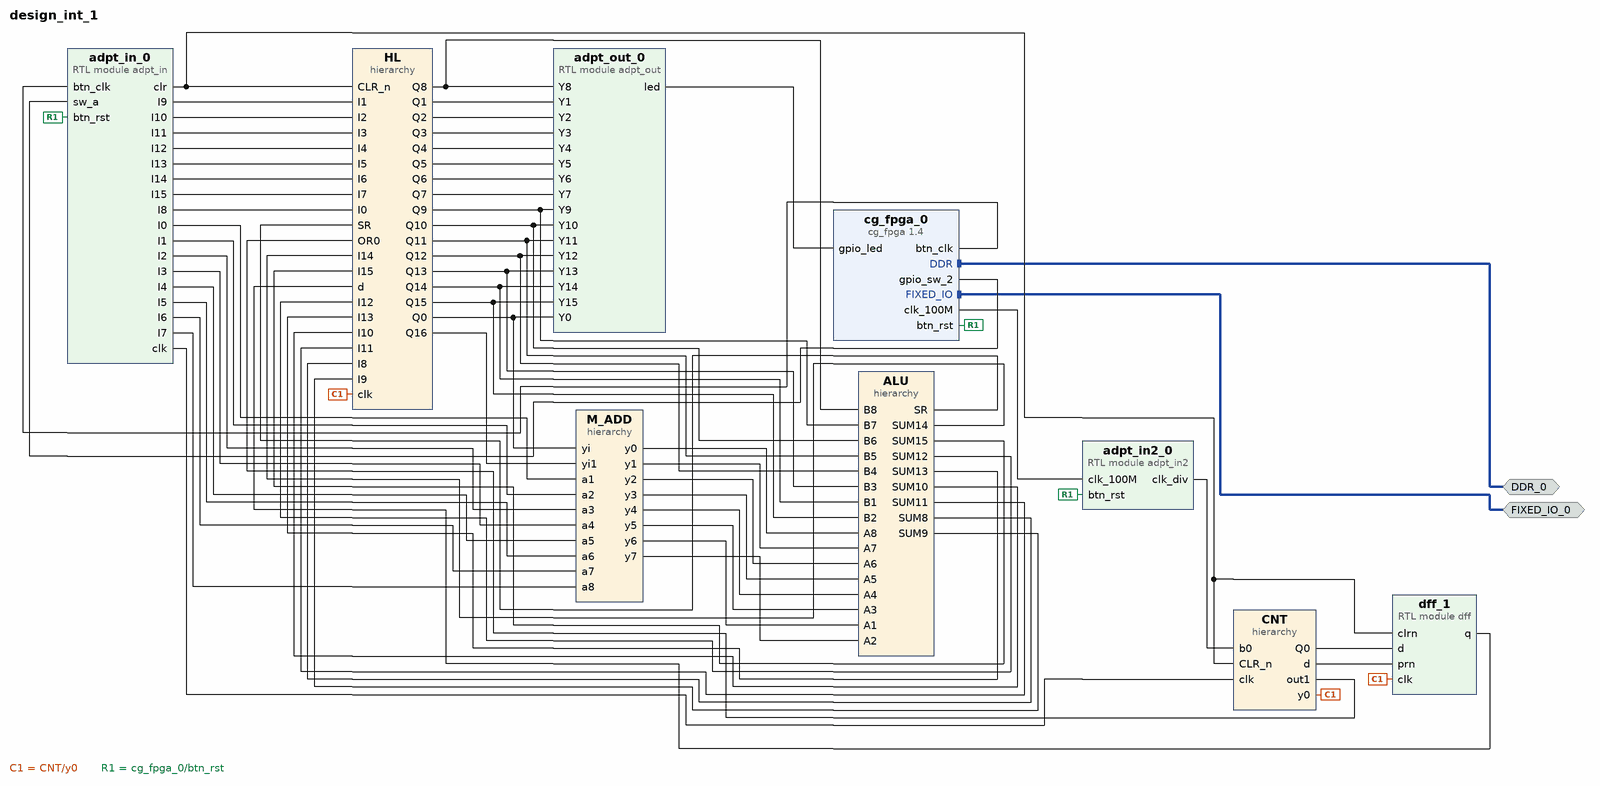
[diagram p0: block diagram of the top level]
# Vivado block design design_int_1, xc7z020clg400-1, Vivado 2024.2
create_bd_design design_int_1

create_bd_intf_port -mode Master -vlnv xilinx.com:display_processing_system7:fixedio_rtl:1.0 FIXED_IO_0
create_bd_intf_port -mode Master -vlnv xilinx.com:interface:ddrx_rtl:1.0 DDR_0

create_bd_cell -type ip -vlnv educg.net:user:cg_fpga:1.4 cg_fpga_0
create_bd_cell -type module -reference adpt_in adpt_in_0
create_bd_cell -type module -reference adpt_out adpt_out_0
create_bd_cell -type hier HL
create_bd_cell -type hier ALU
create_bd_cell -type module -reference dff dff_1
create_bd_cell -type module -reference adpt_in2 adpt_in2_0
create_bd_cell -type hier CNT
create_bd_cell -type hier M_ADD

# ---- hierarchy /HL ----
current_bd_instance /HL
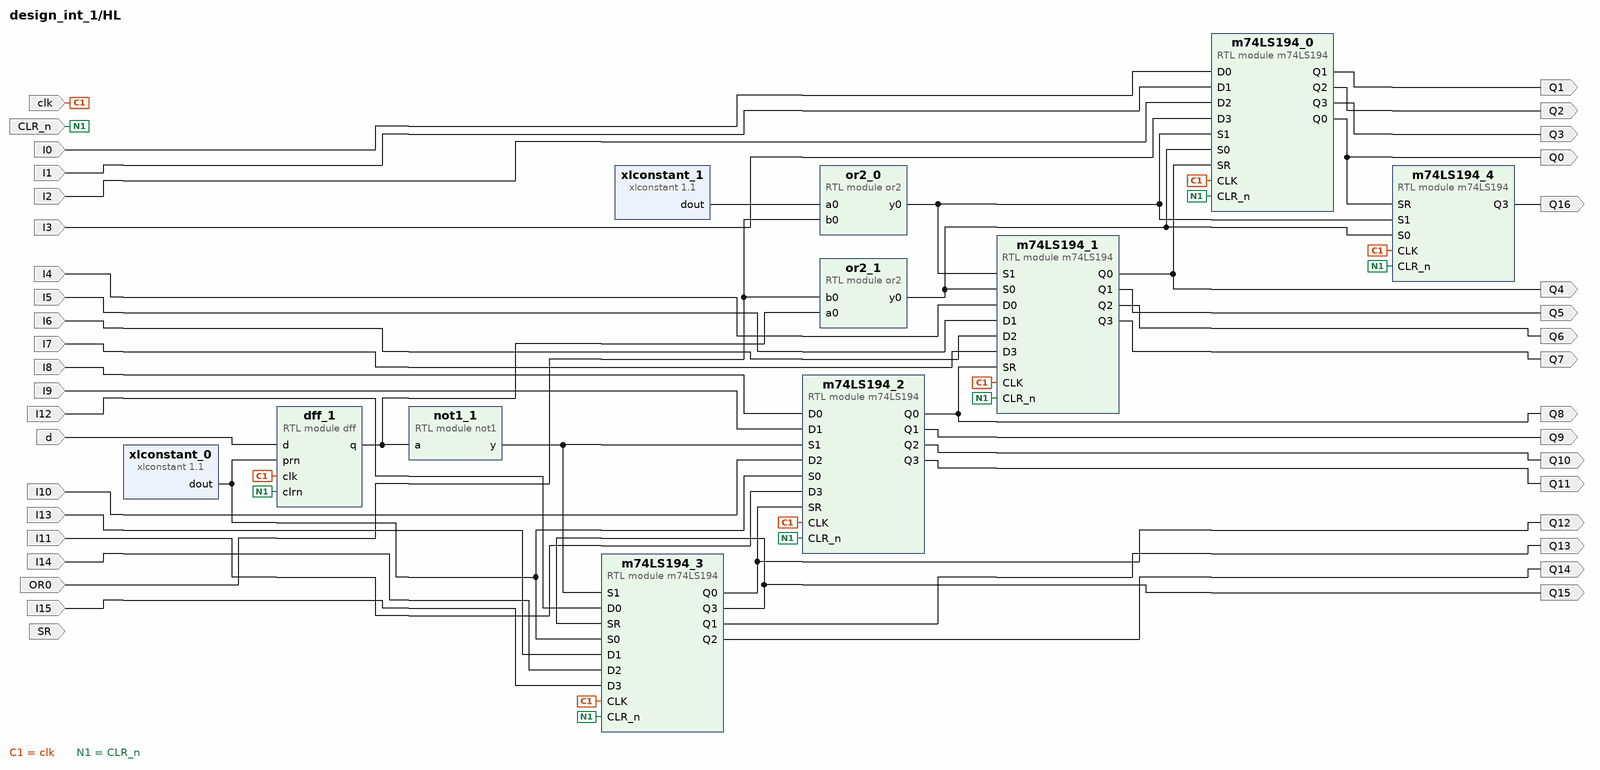
[diagram p1: block diagram inside /HL]
create_bd_pin -dir I -type clk clk
create_bd_pin -dir I CLR_n
create_bd_pin -dir I I3
create_bd_pin -dir I I2
create_bd_pin -dir I I1
create_bd_pin -dir I I0
create_bd_pin -dir O Q4
create_bd_pin -dir O Q3
create_bd_pin -dir O Q2
create_bd_pin -dir O Q1
create_bd_pin -dir O Q0
create_bd_pin -dir I I7
create_bd_pin -dir I I6
create_bd_pin -dir I I5
create_bd_pin -dir I I4
create_bd_pin -dir O Q8
create_bd_pin -dir O Q7
create_bd_pin -dir O Q6
create_bd_pin -dir O Q5
create_bd_pin -dir I I11
create_bd_pin -dir I I10
create_bd_pin -dir I I9
create_bd_pin -dir I I8
create_bd_pin -dir O Q12
create_bd_pin -dir O Q11
create_bd_pin -dir O Q10
create_bd_pin -dir O Q9
create_bd_pin -dir I I15
create_bd_pin -dir I I14
create_bd_pin -dir I I13
create_bd_pin -dir I I12
create_bd_pin -dir O Q15
create_bd_pin -dir O Q14
create_bd_pin -dir O Q13
create_bd_pin -dir I SR
create_bd_pin -dir I d
create_bd_pin -dir I OR0
create_bd_pin -dir O Q16

create_bd_cell -type module -reference m74LS194 m74LS194_0
create_bd_cell -type module -reference m74LS194 m74LS194_1
create_bd_cell -type module -reference m74LS194 m74LS194_2
create_bd_cell -type module -reference m74LS194 m74LS194_3
create_bd_cell -type module -reference dff dff_1
create_bd_cell -type module -reference not1 not1_1
create_bd_cell -type ip -vlnv xilinx.com:ip:xlconstant:1.1 xlconstant_0
create_bd_cell -type ip -vlnv xilinx.com:ip:xlconstant:1.1 xlconstant_1
set_property -dict {CONFIG.CONST_VAL 0} [get_bd_cells xlconstant_1]
create_bd_cell -type module -reference or2 or2_0
create_bd_cell -type module -reference or2 or2_1
create_bd_cell -type module -reference m74LS194 m74LS194_4

# ---- hierarchy /ALU ----
current_bd_instance /ALU
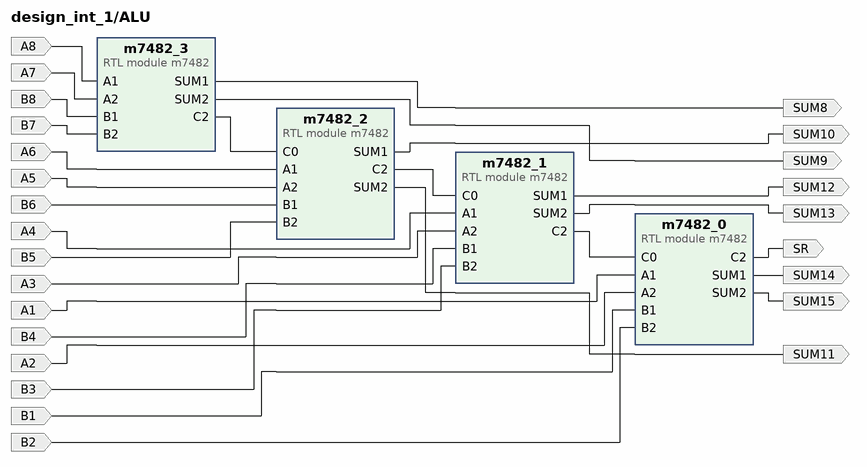
[diagram p2: block diagram inside /ALU]
create_bd_pin -dir I A2
create_bd_pin -dir I A1
create_bd_pin -dir I B2
create_bd_pin -dir I B1
create_bd_pin -dir O SUM15
create_bd_pin -dir O SUM14
create_bd_pin -dir O SR
create_bd_pin -dir I A3
create_bd_pin -dir I A4
create_bd_pin -dir I B3
create_bd_pin -dir I B4
create_bd_pin -dir O SUM13
create_bd_pin -dir O SUM12
create_bd_pin -dir I A5
create_bd_pin -dir I A6
create_bd_pin -dir I B5
create_bd_pin -dir I B6
create_bd_pin -dir O SUM11
create_bd_pin -dir O SUM10
create_bd_pin -dir I A7
create_bd_pin -dir I A8
create_bd_pin -dir I B7
create_bd_pin -dir I B8
create_bd_pin -dir O SUM9
create_bd_pin -dir O SUM8

create_bd_cell -type module -reference m7482 m7482_0
create_bd_cell -type module -reference m7482 m7482_1
create_bd_cell -type module -reference m7482 m7482_2
create_bd_cell -type module -reference m7482 m7482_3

# ---- hierarchy /CNT ----
current_bd_instance /CNT
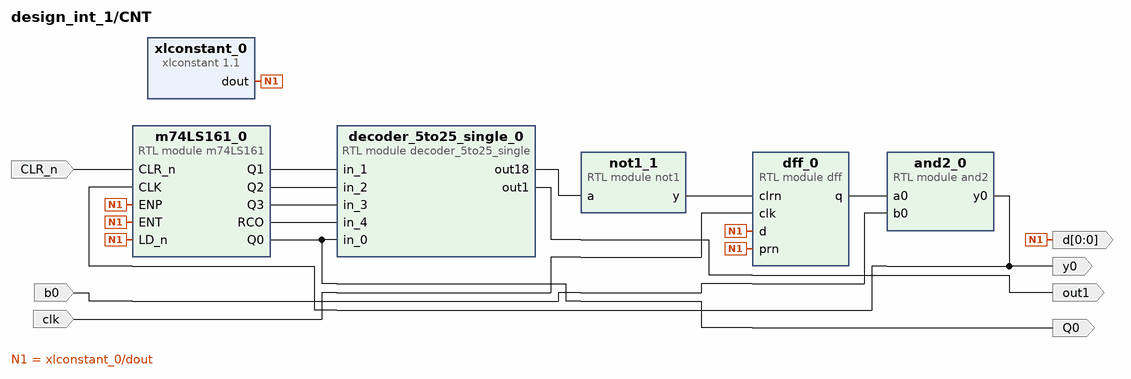
[diagram p3: block diagram inside /CNT]
create_bd_pin -dir O Q0
create_bd_pin -dir O out1
create_bd_pin -dir O -from 0 -to 0 d
create_bd_pin -dir O y0
create_bd_pin -dir I CLR_n
create_bd_pin -dir I -type clk clk
create_bd_pin -dir I b0

create_bd_cell -type module -reference decoder_5to25_single decoder_5to25_single_0
create_bd_cell -type ip -vlnv xilinx.com:ip:xlconstant:1.1 xlconstant_0
create_bd_cell -type module -reference m74LS161 m74LS161_0
create_bd_cell -type module -reference dff dff_0
create_bd_cell -type module -reference not1 not1_1
create_bd_cell -type module -reference and2 and2_0

# ---- hierarchy /M_ADD ----
current_bd_instance /M_ADD
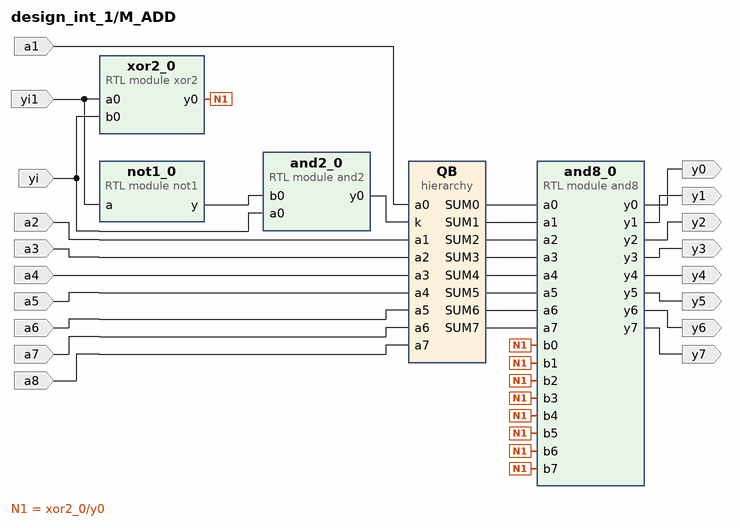
[diagram p4: block diagram inside /M_ADD]
create_bd_pin -dir O y0
create_bd_pin -dir O y1
create_bd_pin -dir O y2
create_bd_pin -dir O y3
create_bd_pin -dir O y4
create_bd_pin -dir O y5
create_bd_pin -dir O y6
create_bd_pin -dir O y7
create_bd_pin -dir I yi1
create_bd_pin -dir I yi
create_bd_pin -dir I a1
create_bd_pin -dir I a2
create_bd_pin -dir I a3
create_bd_pin -dir I a4
create_bd_pin -dir I a5
create_bd_pin -dir I a6
create_bd_pin -dir I a7
create_bd_pin -dir I a8

create_bd_cell -type module -reference and8 and8_0
create_bd_cell -type module -reference xor2 xor2_0
create_bd_cell -type module -reference and2 and2_0
create_bd_cell -type module -reference not1 not1_0
create_bd_cell -type hier QB

# ---- hierarchy /M_ADD/QB ----
current_bd_instance /M_ADD/QB
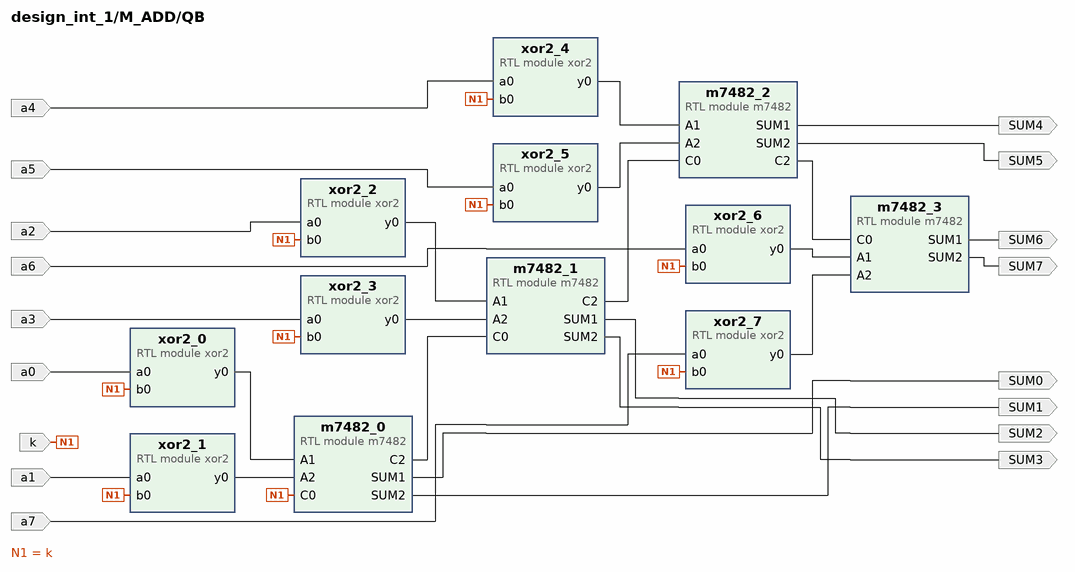
[diagram p5: block diagram inside /M_ADD/QB]
create_bd_pin -dir I a0
create_bd_pin -dir I k
create_bd_pin -dir I a1
create_bd_pin -dir O SUM1
create_bd_pin -dir O SUM0
create_bd_pin -dir I a2
create_bd_pin -dir I a3
create_bd_pin -dir O SUM3
create_bd_pin -dir O SUM2
create_bd_pin -dir O SUM5
create_bd_pin -dir O SUM4
create_bd_pin -dir I a4
create_bd_pin -dir I a5
create_bd_pin -dir I a6
create_bd_pin -dir I a7
create_bd_pin -dir O SUM7
create_bd_pin -dir O SUM6

create_bd_cell -type module -reference xor2 xor2_0
create_bd_cell -type module -reference xor2 xor2_1
create_bd_cell -type module -reference m7482 m7482_0
create_bd_cell -type module -reference xor2 xor2_2
create_bd_cell -type module -reference xor2 xor2_3
create_bd_cell -type module -reference m7482 m7482_1
create_bd_cell -type module -reference m7482 m7482_2
create_bd_cell -type module -reference xor2 xor2_4
create_bd_cell -type module -reference xor2 xor2_5
create_bd_cell -type module -reference xor2 xor2_6
create_bd_cell -type module -reference xor2 xor2_7
create_bd_cell -type module -reference m7482 m7482_3

# ---- connections ----

current_bd_instance /HL
connect_bd_net -net adpt_in_0_I0 [get_bd_pins I0] [get_bd_pins m74LS194_0/D0]
connect_bd_net -net adpt_in_0_I1 [get_bd_pins I1] [get_bd_pins m74LS194_0/D1]
connect_bd_net -net adpt_in_0_I2 [get_bd_pins I2] [get_bd_pins m74LS194_0/D2]
connect_bd_net -net adpt_in_0_I3 [get_bd_pins I3] [get_bd_pins m74LS194_0/D3]
connect_bd_net -net adpt_in_0_I4 [get_bd_pins I4] [get_bd_pins m74LS194_1/D0]
connect_bd_net -net adpt_in_0_I5 [get_bd_pins I5] [get_bd_pins m74LS194_1/D1]
connect_bd_net -net adpt_in_0_I6 [get_bd_pins I6] [get_bd_pins m74LS194_1/D2]
connect_bd_net -net adpt_in_0_I7 [get_bd_pins I7] [get_bd_pins m74LS194_1/D3]
connect_bd_net -net adpt_in_0_I8 [get_bd_pins I8] [get_bd_pins m74LS194_2/D0]
connect_bd_net -net adpt_in_0_I9 [get_bd_pins I9] [get_bd_pins m74LS194_2/D1]
connect_bd_net -net adpt_in_0_I10 [get_bd_pins I10] [get_bd_pins m74LS194_2/D2]
connect_bd_net -net adpt_in_0_I11 [get_bd_pins I11] [get_bd_pins m74LS194_2/D3]
connect_bd_net -net adpt_in_0_I12 [get_bd_pins I12] [get_bd_pins m74LS194_3/D0]
connect_bd_net -net adpt_in_0_I13 [get_bd_pins I13] [get_bd_pins m74LS194_3/D1]
connect_bd_net -net adpt_in_0_I14 [get_bd_pins I14] [get_bd_pins m74LS194_3/D2]
connect_bd_net -net adpt_in_0_I15 [get_bd_pins I15] [get_bd_pins m74LS194_3/D3]
connect_bd_net -net adpt_in_0_clk [get_bd_pins clk] \
  [get_bd_pins dff_1/clk] [get_bd_pins m74LS194_0/CLK] [get_bd_pins m74LS194_1/CLK] [get_bd_pins m74LS194_2/CLK] \
  [get_bd_pins m74LS194_3/CLK] [get_bd_pins m74LS194_4/CLK]
connect_bd_net -net adpt_in_0_clr [get_bd_pins CLR_n] \
  [get_bd_pins dff_1/clrn] [get_bd_pins m74LS194_0/CLR_n] [get_bd_pins m74LS194_1/CLR_n] [get_bd_pins m74LS194_2/CLR_n] \
  [get_bd_pins m74LS194_3/CLR_n] [get_bd_pins m74LS194_4/CLR_n]
connect_bd_net -net b0_1 [get_bd_pins OR0] [get_bd_pins or2_0/b0] [get_bd_pins or2_1/b0]
connect_bd_net [get_bd_pins d] [get_bd_pins dff_1/d]
connect_bd_net [get_bd_pins dff_1/q] [get_bd_pins not1_1/a] [get_bd_pins or2_1/a0]
connect_bd_net [get_bd_pins m74LS194_0/Q0] [get_bd_pins Q0] [get_bd_pins m74LS194_4/SR]
connect_bd_net [get_bd_pins m74LS194_0/Q1] [get_bd_pins Q1]
connect_bd_net [get_bd_pins m74LS194_0/Q2] [get_bd_pins Q2]
connect_bd_net [get_bd_pins m74LS194_0/Q3] [get_bd_pins Q3]
connect_bd_net [get_bd_pins m74LS194_1/Q0] [get_bd_pins Q4] [get_bd_pins m74LS194_0/SR]
connect_bd_net [get_bd_pins m74LS194_1/Q1] [get_bd_pins Q5]
connect_bd_net [get_bd_pins m74LS194_1/Q2] [get_bd_pins Q6]
connect_bd_net [get_bd_pins m74LS194_1/Q3] [get_bd_pins Q7]
connect_bd_net [get_bd_pins m74LS194_2/Q0] [get_bd_pins Q8] [get_bd_pins m74LS194_1/SR]
connect_bd_net [get_bd_pins m74LS194_2/Q1] [get_bd_pins Q9]
connect_bd_net [get_bd_pins m74LS194_2/Q2] [get_bd_pins Q10]
connect_bd_net [get_bd_pins m74LS194_2/Q3] [get_bd_pins Q11]
connect_bd_net [get_bd_pins m74LS194_3/Q0] [get_bd_pins Q12] [get_bd_pins m74LS194_2/SR]
connect_bd_net [get_bd_pins m74LS194_3/Q1] [get_bd_pins Q13]
connect_bd_net [get_bd_pins m74LS194_3/Q2] [get_bd_pins Q14]
connect_bd_net [get_bd_pins m74LS194_3/Q3] [get_bd_pins Q15] [get_bd_pins m74LS194_3/SR]
connect_bd_net [get_bd_pins m74LS194_4/Q3] [get_bd_pins Q16]
connect_bd_net [get_bd_pins not1_1/y] [get_bd_pins m74LS194_2/S1] [get_bd_pins m74LS194_3/S1]
connect_bd_net [get_bd_pins or2_0/y0] [get_bd_pins m74LS194_0/S1] [get_bd_pins m74LS194_1/S1] [get_bd_pins m74LS194_4/S1]
connect_bd_net [get_bd_pins or2_1/y0] [get_bd_pins m74LS194_0/S0] [get_bd_pins m74LS194_1/S0] [get_bd_pins m74LS194_4/S0]
connect_bd_net [get_bd_pins xlconstant_0/dout] [get_bd_pins dff_1/prn] [get_bd_pins m74LS194_2/S0] [get_bd_pins m74LS194_3/S0]
connect_bd_net [get_bd_pins xlconstant_1/dout] [get_bd_pins or2_0/a0]

current_bd_instance /ALU
connect_bd_net -net and8_0_y0 [get_bd_pins A8] [get_bd_pins m7482_3/A1]
connect_bd_net -net and8_0_y1 [get_bd_pins A7] [get_bd_pins m7482_3/A2]
connect_bd_net -net and8_0_y2 [get_bd_pins A6] [get_bd_pins m7482_2/A1]
connect_bd_net -net and8_0_y3 [get_bd_pins A5] [get_bd_pins m7482_2/A2]
connect_bd_net -net and8_0_y4 [get_bd_pins A4] [get_bd_pins m7482_1/A1]
connect_bd_net -net and8_0_y5 [get_bd_pins A3] [get_bd_pins m7482_1/A2]
connect_bd_net -net and8_0_y6 [get_bd_pins A1] [get_bd_pins m7482_0/A1]
connect_bd_net -net and8_0_y7 [get_bd_pins A2] [get_bd_pins m7482_0/A2]
connect_bd_net [get_bd_pins m7482_0/C2] [get_bd_pins SR]
connect_bd_net [get_bd_pins m7482_0/SUM1] [get_bd_pins SUM14]
connect_bd_net [get_bd_pins m7482_0/SUM2] [get_bd_pins SUM15]
connect_bd_net [get_bd_pins m7482_1/C2] [get_bd_pins m7482_0/C0]
connect_bd_net [get_bd_pins m7482_1/SUM1] [get_bd_pins SUM12]
connect_bd_net [get_bd_pins m7482_1/SUM2] [get_bd_pins SUM13]
connect_bd_net [get_bd_pins m7482_2/C2] [get_bd_pins m7482_1/C0]
connect_bd_net [get_bd_pins m7482_2/SUM1] [get_bd_pins SUM10]
connect_bd_net [get_bd_pins m7482_2/SUM2] [get_bd_pins SUM11]
connect_bd_net [get_bd_pins m7482_3/C2] [get_bd_pins m7482_2/C0]
connect_bd_net [get_bd_pins m7482_3/SUM1] [get_bd_pins SUM8]
connect_bd_net [get_bd_pins m7482_3/SUM2] [get_bd_pins SUM9]
connect_bd_net -net m74LS194_2_Q0 [get_bd_pins B8] [get_bd_pins m7482_3/B1]
connect_bd_net -net m74LS194_2_Q1 [get_bd_pins B7] [get_bd_pins m7482_3/B2]
connect_bd_net -net m74LS194_2_Q2 [get_bd_pins B6] [get_bd_pins m7482_2/B1]
connect_bd_net -net m74LS194_2_Q3 [get_bd_pins B5] [get_bd_pins m7482_2/B2]
connect_bd_net -net m74LS194_3_Q0 [get_bd_pins B4] [get_bd_pins m7482_1/B1]
connect_bd_net -net m74LS194_3_Q1 [get_bd_pins B3] [get_bd_pins m7482_1/B2]
connect_bd_net -net m74LS194_3_Q2 [get_bd_pins B1] [get_bd_pins m7482_0/B1]
connect_bd_net -net m74LS194_3_Q3 [get_bd_pins B2] [get_bd_pins m7482_0/B2]

current_bd_instance /CNT
connect_bd_net [get_bd_pins CLR_n] [get_bd_pins m74LS161_0/CLR_n]
connect_bd_net -net adpt_in2_0_clk_div [get_bd_pins b0] [get_bd_pins and2_0/b0]
connect_bd_net -net adpt_in_0_clk [get_bd_pins and2_0/y0] [get_bd_pins y0] [get_bd_pins m74LS161_0/CLK]
connect_bd_net -net adpt_in_0_clk1 [get_bd_pins clk] [get_bd_pins dff_0/clk]
connect_bd_net [get_bd_pins decoder_5to25_single_0/out1] [get_bd_pins out1]
connect_bd_net [get_bd_pins decoder_5to25_single_0/out18] [get_bd_pins not1_1/a]
connect_bd_net [get_bd_pins dff_0/q] [get_bd_pins and2_0/a0]
connect_bd_net [get_bd_pins m74LS161_0/Q0] [get_bd_pins Q0] [get_bd_pins decoder_5to25_single_0/in_0]
connect_bd_net [get_bd_pins m74LS161_0/Q1] [get_bd_pins decoder_5to25_single_0/in_1]
connect_bd_net [get_bd_pins m74LS161_0/Q2] [get_bd_pins decoder_5to25_single_0/in_2]
connect_bd_net [get_bd_pins m74LS161_0/Q3] [get_bd_pins decoder_5to25_single_0/in_3]
connect_bd_net [get_bd_pins m74LS161_0/RCO] [get_bd_pins decoder_5to25_single_0/in_4]
connect_bd_net [get_bd_pins not1_1/y] [get_bd_pins dff_0/clrn]
connect_bd_net [get_bd_pins xlconstant_0/dout] \
  [get_bd_pins d] [get_bd_pins dff_0/d] [get_bd_pins dff_0/prn] [get_bd_pins m74LS161_0/ENP] [get_bd_pins m74LS161_0/ENT] \
  [get_bd_pins m74LS161_0/LD_n]

current_bd_instance /M_ADD
connect_bd_net -net HL_Q0 [get_bd_pins yi1] [get_bd_pins not1_0/a] [get_bd_pins xor2_0/a0]
connect_bd_net -net adpt_in_0_I0 [get_bd_pins a1] [get_bd_pins QB/a0]
connect_bd_net -net adpt_in_0_I1 [get_bd_pins a2] [get_bd_pins QB/a1]
connect_bd_net -net adpt_in_0_I2 [get_bd_pins a3] [get_bd_pins QB/a2]
connect_bd_net -net adpt_in_0_I3 [get_bd_pins a4] [get_bd_pins QB/a3]
connect_bd_net -net adpt_in_0_I4 [get_bd_pins a5] [get_bd_pins QB/a4]
connect_bd_net -net adpt_in_0_I5 [get_bd_pins a6] [get_bd_pins QB/a5]
connect_bd_net -net adpt_in_0_I6 [get_bd_pins a7] [get_bd_pins QB/a6]
connect_bd_net -net adpt_in_0_I7 [get_bd_pins a8] [get_bd_pins QB/a7]
connect_bd_net [get_bd_pins and8_0/y0] [get_bd_pins y0]
connect_bd_net [get_bd_pins and8_0/y1] [get_bd_pins y1]
connect_bd_net [get_bd_pins and8_0/y2] [get_bd_pins y2]
connect_bd_net [get_bd_pins and8_0/y3] [get_bd_pins y3]
connect_bd_net [get_bd_pins and8_0/y4] [get_bd_pins y4]
connect_bd_net [get_bd_pins and8_0/y5] [get_bd_pins y5]
connect_bd_net [get_bd_pins and8_0/y6] [get_bd_pins y6]
connect_bd_net [get_bd_pins and8_0/y7] [get_bd_pins y7]
connect_bd_net -net k_1 [get_bd_pins and2_0/y0] [get_bd_pins QB/k]
connect_bd_net -net m7482_0_SUM3 [get_bd_pins QB/SUM0] [get_bd_pins and8_0/a0]
connect_bd_net -net m7482_0_SUM4 [get_bd_pins QB/SUM1] [get_bd_pins and8_0/a1]
connect_bd_net -net m7482_1_SUM3 [get_bd_pins QB/SUM2] [get_bd_pins and8_0/a2]
connect_bd_net -net m7482_1_SUM4 [get_bd_pins QB/SUM3] [get_bd_pins and8_0/a3]
connect_bd_net -net m7482_2_SUM3 [get_bd_pins QB/SUM4] [get_bd_pins and8_0/a4]
connect_bd_net -net m7482_2_SUM4 [get_bd_pins QB/SUM5] [get_bd_pins and8_0/a5]
connect_bd_net -net m7482_3_SUM3 [get_bd_pins QB/SUM6] [get_bd_pins and8_0/a6]
connect_bd_net -net m7482_3_SUM4 [get_bd_pins QB/SUM7] [get_bd_pins and8_0/a7]
connect_bd_net -net m74LS194_0_Q0 [get_bd_pins xor2_0/y0] \
  [get_bd_pins and8_0/b0] [get_bd_pins and8_0/b7] [get_bd_pins and8_0/b6] [get_bd_pins and8_0/b5] [get_bd_pins and8_0/b4] \
  [get_bd_pins and8_0/b3] [get_bd_pins and8_0/b2] [get_bd_pins and8_0/b1]
connect_bd_net -net m74LS194_0_Q1 [get_bd_pins yi] [get_bd_pins and2_0/a0] [get_bd_pins xor2_0/b0]
connect_bd_net [get_bd_pins not1_0/y] [get_bd_pins and2_0/b0]

current_bd_instance /M_ADD/QB
connect_bd_net -net adpt_in_0_I0 [get_bd_pins a0] [get_bd_pins xor2_0/a0]
connect_bd_net -net adpt_in_0_I1 [get_bd_pins a1] [get_bd_pins xor2_1/a0]
connect_bd_net -net adpt_in_0_I2 [get_bd_pins a2] [get_bd_pins xor2_2/a0]
connect_bd_net -net adpt_in_0_I3 [get_bd_pins a3] [get_bd_pins xor2_3/a0]
connect_bd_net -net adpt_in_0_I4 [get_bd_pins a4] [get_bd_pins xor2_4/a0]
connect_bd_net -net adpt_in_0_I5 [get_bd_pins a5] [get_bd_pins xor2_5/a0]
connect_bd_net -net adpt_in_0_I6 [get_bd_pins a6] [get_bd_pins xor2_6/a0]
connect_bd_net -net adpt_in_0_I7 [get_bd_pins a7] [get_bd_pins xor2_7/a0]
connect_bd_net [get_bd_pins m7482_0/C2] [get_bd_pins m7482_1/C0]
connect_bd_net [get_bd_pins m7482_0/SUM1] [get_bd_pins SUM0]
connect_bd_net [get_bd_pins m7482_0/SUM2] [get_bd_pins SUM1]
connect_bd_net [get_bd_pins m7482_1/C2] [get_bd_pins m7482_2/C0]
connect_bd_net [get_bd_pins m7482_1/SUM1] [get_bd_pins SUM2]
connect_bd_net [get_bd_pins m7482_1/SUM2] [get_bd_pins SUM3]
connect_bd_net [get_bd_pins m7482_2/C2] [get_bd_pins m7482_3/C0]
connect_bd_net [get_bd_pins m7482_2/SUM1] [get_bd_pins SUM4]
connect_bd_net [get_bd_pins m7482_2/SUM2] [get_bd_pins SUM5]
connect_bd_net [get_bd_pins m7482_3/SUM1] [get_bd_pins SUM6]
connect_bd_net [get_bd_pins m7482_3/SUM2] [get_bd_pins SUM7]
connect_bd_net -net xlconstant_0_dout1 [get_bd_pins k] \
  [get_bd_pins xor2_7/b0] [get_bd_pins xor2_6/b0] [get_bd_pins xor2_5/b0] [get_bd_pins xor2_4/b0] [get_bd_pins xor2_3/b0] \
  [get_bd_pins xor2_2/b0] [get_bd_pins xor2_1/b0] [get_bd_pins m7482_0/C0] [get_bd_pins xor2_0/b0]
connect_bd_net [get_bd_pins xor2_0/y0] [get_bd_pins m7482_0/A1]
connect_bd_net [get_bd_pins xor2_1/y0] [get_bd_pins m7482_0/A2]
connect_bd_net [get_bd_pins xor2_2/y0] [get_bd_pins m7482_1/A1]
connect_bd_net [get_bd_pins xor2_3/y0] [get_bd_pins m7482_1/A2]
connect_bd_net [get_bd_pins xor2_4/y0] [get_bd_pins m7482_2/A1]
connect_bd_net [get_bd_pins xor2_5/y0] [get_bd_pins m7482_2/A2]
connect_bd_net [get_bd_pins xor2_6/y0] [get_bd_pins m7482_3/A1]
connect_bd_net [get_bd_pins xor2_7/y0] [get_bd_pins m7482_3/A2]

current_bd_instance /
connect_bd_intf_net [get_bd_intf_ports DDR_0] [get_bd_intf_pins cg_fpga_0/DDR]
connect_bd_intf_net [get_bd_intf_ports FIXED_IO_0] [get_bd_intf_pins cg_fpga_0/FIXED_IO]
connect_bd_net -net CLR_n_1 [get_bd_pins adpt_in_0/clr] [get_bd_pins HL/CLR_n] [get_bd_pins dff_1/clrn] [get_bd_pins CNT/CLR_n]
connect_bd_net [get_bd_pins HL/Q0] [get_bd_pins adpt_out_0/Y0] [get_bd_pins M_ADD/yi]
connect_bd_net -net I1_1 [get_bd_pins adpt_in_0/I9] [get_bd_pins HL/I1]
connect_bd_net -net I2_1 [get_bd_pins adpt_in_0/I10] [get_bd_pins HL/I2]
connect_bd_net -net I3_1 [get_bd_pins adpt_in_0/I11] [get_bd_pins HL/I3]
connect_bd_net -net I4_1 [get_bd_pins adpt_in_0/I12] [get_bd_pins HL/I4]
connect_bd_net -net I5_1 [get_bd_pins adpt_in_0/I13] [get_bd_pins HL/I5]
connect_bd_net -net I6_1 [get_bd_pins adpt_in_0/I14] [get_bd_pins HL/I6]
connect_bd_net -net I7_1 [get_bd_pins adpt_in_0/I15] [get_bd_pins HL/I7]
connect_bd_net [get_bd_pins adpt_in2_0/clk_div] [get_bd_pins CNT/b0]
connect_bd_net [get_bd_pins adpt_in_0/I0] [get_bd_pins M_ADD/a1]
connect_bd_net [get_bd_pins adpt_in_0/I1] [get_bd_pins M_ADD/a2]
connect_bd_net [get_bd_pins adpt_in_0/I2] [get_bd_pins M_ADD/a3]
connect_bd_net [get_bd_pins adpt_in_0/I3] [get_bd_pins M_ADD/a4]
connect_bd_net [get_bd_pins adpt_in_0/I4] [get_bd_pins M_ADD/a5]
connect_bd_net [get_bd_pins adpt_in_0/I5] [get_bd_pins M_ADD/a6]
connect_bd_net [get_bd_pins adpt_in_0/I6] [get_bd_pins M_ADD/a7]
connect_bd_net [get_bd_pins adpt_in_0/I7] [get_bd_pins M_ADD/a8]
connect_bd_net [get_bd_pins adpt_in_0/I8] [get_bd_pins HL/I0]
connect_bd_net -net adpt_in_0_clk [get_bd_pins CNT/y0] [get_bd_pins HL/clk] [get_bd_pins dff_1/clk]
connect_bd_net [get_bd_pins adpt_in_0/clk] [get_bd_pins CNT/clk]
connect_bd_net [get_bd_pins adpt_out_0/led] [get_bd_pins cg_fpga_0/gpio_led]
connect_bd_net -net and8_0_y0 [get_bd_pins M_ADD/y0] [get_bd_pins ALU/A8]
connect_bd_net -net and8_0_y1 [get_bd_pins M_ADD/y1] [get_bd_pins ALU/A7]
connect_bd_net -net and8_0_y2 [get_bd_pins M_ADD/y2] [get_bd_pins ALU/A6]
connect_bd_net -net and8_0_y3 [get_bd_pins M_ADD/y3] [get_bd_pins ALU/A5]
connect_bd_net -net and8_0_y4 [get_bd_pins M_ADD/y4] [get_bd_pins ALU/A4]
connect_bd_net -net and8_0_y5 [get_bd_pins M_ADD/y5] [get_bd_pins ALU/A3]
connect_bd_net -net and8_0_y6 [get_bd_pins M_ADD/y6] [get_bd_pins ALU/A1]
connect_bd_net -net and8_0_y7 [get_bd_pins M_ADD/y7] [get_bd_pins ALU/A2]
connect_bd_net [get_bd_pins cg_fpga_0/btn_clk] [get_bd_pins adpt_in_0/btn_clk]
connect_bd_net [get_bd_pins cg_fpga_0/btn_rst] [get_bd_pins adpt_in2_0/btn_rst] [get_bd_pins adpt_in_0/btn_rst]
connect_bd_net [get_bd_pins cg_fpga_0/clk_100M] [get_bd_pins adpt_in2_0/clk_100M]
connect_bd_net [get_bd_pins cg_fpga_0/gpio_sw_2] [get_bd_pins adpt_in_0/sw_a]
connect_bd_net -net decoder_5to25_single_0_out1 [get_bd_pins CNT/out1] [get_bd_pins HL/OR0]
connect_bd_net [get_bd_pins dff_1/q] [get_bd_pins HL/d]
connect_bd_net -net m7482_0_C2 [get_bd_pins ALU/SR] [get_bd_pins HL/SR]
connect_bd_net -net m7482_0_SUM1 [get_bd_pins ALU/SUM14] [get_bd_pins HL/I14]
connect_bd_net -net m7482_0_SUM2 [get_bd_pins ALU/SUM15] [get_bd_pins HL/I15]
connect_bd_net -net m7482_1_SUM1 [get_bd_pins ALU/SUM12] [get_bd_pins HL/I12]
connect_bd_net -net m7482_1_SUM2 [get_bd_pins ALU/SUM13] [get_bd_pins HL/I13]
connect_bd_net -net m7482_2_SUM1 [get_bd_pins ALU/SUM10] [get_bd_pins HL/I10]
connect_bd_net -net m7482_2_SUM2 [get_bd_pins ALU/SUM11] [get_bd_pins HL/I11]
connect_bd_net -net m7482_3_SUM1 [get_bd_pins ALU/SUM8] [get_bd_pins HL/I8]
connect_bd_net -net m7482_3_SUM2 [get_bd_pins ALU/SUM9] [get_bd_pins HL/I9]
connect_bd_net -net m74LS161_0_Q0 [get_bd_pins CNT/Q0] [get_bd_pins dff_1/d]
connect_bd_net -net m74LS194_0_Q1 [get_bd_pins HL/Q1] [get_bd_pins adpt_out_0/Y1]
connect_bd_net -net m74LS194_0_Q2 [get_bd_pins HL/Q2] [get_bd_pins adpt_out_0/Y2]
connect_bd_net -net m74LS194_0_Q3 [get_bd_pins HL/Q3] [get_bd_pins adpt_out_0/Y3]
connect_bd_net -net m74LS194_1_Q0 [get_bd_pins HL/Q4] [get_bd_pins adpt_out_0/Y4]
connect_bd_net -net m74LS194_1_Q1 [get_bd_pins HL/Q5] [get_bd_pins adpt_out_0/Y5]
connect_bd_net -net m74LS194_1_Q2 [get_bd_pins HL/Q6] [get_bd_pins adpt_out_0/Y6]
connect_bd_net -net m74LS194_1_Q3 [get_bd_pins HL/Q7] [get_bd_pins adpt_out_0/Y7]
connect_bd_net -net m74LS194_2_Q0 [get_bd_pins HL/Q8] [get_bd_pins ALU/B8] [get_bd_pins adpt_out_0/Y8]
connect_bd_net -net m74LS194_2_Q1 [get_bd_pins HL/Q9] [get_bd_pins ALU/B7] [get_bd_pins adpt_out_0/Y9]
connect_bd_net -net m74LS194_2_Q2 [get_bd_pins HL/Q10] [get_bd_pins ALU/B6] [get_bd_pins adpt_out_0/Y10]
connect_bd_net -net m74LS194_2_Q3 [get_bd_pins HL/Q11] [get_bd_pins ALU/B5] [get_bd_pins adpt_out_0/Y11]
connect_bd_net -net m74LS194_3_Q0 [get_bd_pins HL/Q12] [get_bd_pins ALU/B4] [get_bd_pins adpt_out_0/Y12]
connect_bd_net -net m74LS194_3_Q1 [get_bd_pins HL/Q13] [get_bd_pins ALU/B3] [get_bd_pins adpt_out_0/Y13]
connect_bd_net -net m74LS194_3_Q2 [get_bd_pins HL/Q14] [get_bd_pins ALU/B1] [get_bd_pins adpt_out_0/Y14]
connect_bd_net -net m74LS194_3_Q3 [get_bd_pins HL/Q15] [get_bd_pins ALU/B2] [get_bd_pins adpt_out_0/Y15]
connect_bd_net -net xlconstant_0_dout [get_bd_pins CNT/d] [get_bd_pins dff_1/prn]
connect_bd_net -net yi1_1 [get_bd_pins HL/Q16] [get_bd_pins M_ADD/yi1]

validate_bd_design
save_bd_design
